# Altium schematic sheet System.SchDoc: goBoard
size A4; Engineer: Paul Schneider; Organization: CS122A; DocumentNumber: 1-; Revision: X0; SheetNumber: 1; SheetTotal: 7; IsUserConfigurable: Yes
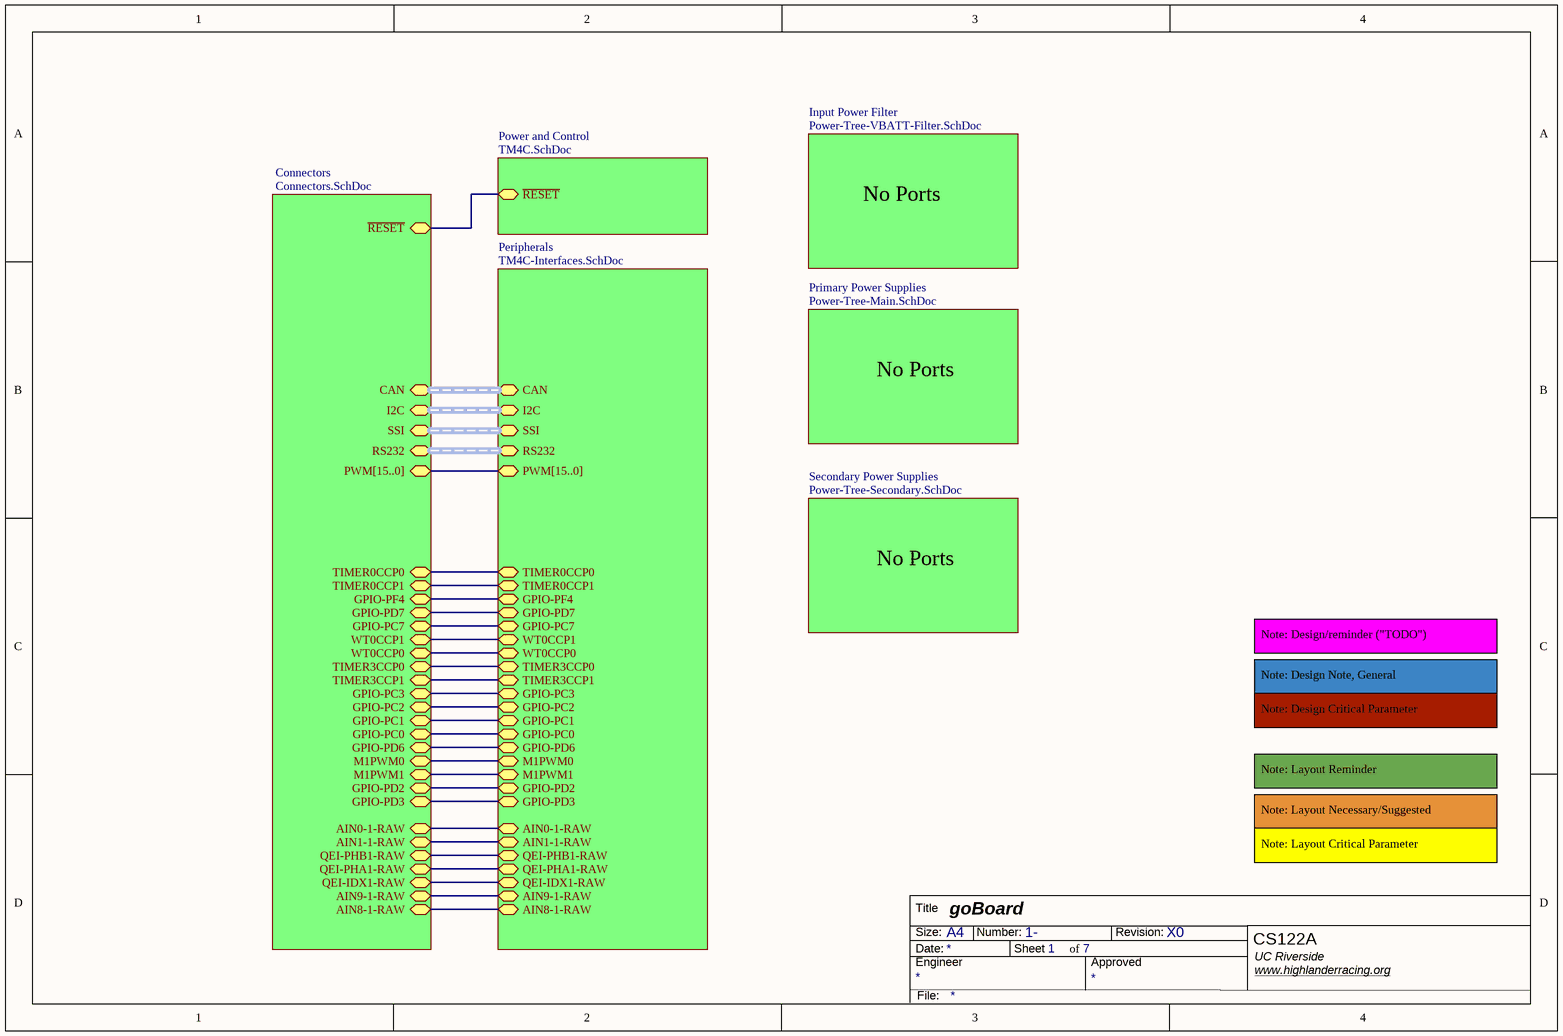
[diagram p0: System.SchDoc]

## Sub-sheets
Connectors = Connectors.SchDoc: CAN (bidir, harness CAN), TIMER0CCP0 (bidir), TIMER0CCP1 (bidir), GPIO-PF4 (bidir), GPIO-PD7 (bidir), GPIO-PC7 (bidir), WT0CCP1 (bidir), WT0CCP0 (bidir), TIMER3CCP0 (bidir), TIMER3CCP1 (bidir), GPIO-PC3 (bidir), GPIO-PC2 (bidir), GPIO-PC1 (bidir), GPIO-PC0 (bidir), GPIO-PD6 (bidir), M1PWM0 (bidir), M1PWM1 (bidir), GPIO-PD2 (bidir), GPIO-PD3 (bidir), AIN0-1-RAW (bidir), AIN1-1-RAW (bidir), QEI-PHB1-RAW (bidir), QEI-PHA1-RAW (bidir), QEI-IDX1-RAW (bidir), AIN9-1-RAW (bidir), AIN8-1-RAW (bidir), SSI (bidir, harness SSI), I2C (bidir, harness I2C), RS232 (bidir, harness RS232), PWM[15..0] (bidir), ~{RESET} (bidir)
Input Power Filter = Power-Tree-VBATT-Filter.SchDoc: no entries
Peripherals = TM4C-Interfaces.SchDoc: CAN (bidir, harness CAN), TIMER0CCP0 (bidir), TIMER0CCP1 (bidir), GPIO-PF4 (bidir), GPIO-PD7 (bidir), GPIO-PC7 (bidir), WT0CCP1 (bidir), WT0CCP0 (bidir), TIMER3CCP0 (bidir), TIMER3CCP1 (bidir), GPIO-PC3 (bidir), GPIO-PC2 (bidir), GPIO-PC1 (bidir), GPIO-PC0 (bidir), GPIO-PD6 (bidir), M1PWM0 (bidir), M1PWM1 (bidir), GPIO-PD2 (bidir), GPIO-PD3 (bidir), AIN0-1-RAW (bidir), AIN1-1-RAW (bidir), QEI-PHB1-RAW (bidir), QEI-PHA1-RAW (bidir), QEI-IDX1-RAW (bidir), AIN9-1-RAW (bidir), AIN8-1-RAW (bidir), PWM[15..0] (bidir), I2C (bidir, harness I2C), SSI (bidir, harness SSI), RS232 (bidir, harness RS232)
Power and Control = TM4C.SchDoc: ~{RESET} (bidir)
Primary Power Supplies = Power-Tree-Main.SchDoc: no entries
Secondary Power Supplies = Power-Tree-Secondary.SchDoc: no entries

## Nets
(unnamed): sheet Connectors/TIMER0CCP0, sheet Peripherals/TIMER0CCP0
(unnamed): sheet Connectors/TIMER0CCP1, sheet Peripherals/TIMER0CCP1
(unnamed): sheet Connectors/GPIO-PF4, sheet Peripherals/GPIO-PF4
(unnamed): sheet Connectors/GPIO-PD7, sheet Peripherals/GPIO-PD7
(unnamed): sheet Connectors/GPIO-PC7, sheet Peripherals/GPIO-PC7
(unnamed): sheet Connectors/WT0CCP1, sheet Peripherals/WT0CCP1
(unnamed): sheet Connectors/WT0CCP0, sheet Peripherals/WT0CCP0
(unnamed): sheet Connectors/TIMER3CCP0, sheet Peripherals/TIMER3CCP0
(unnamed): sheet Connectors/TIMER3CCP1, sheet Peripherals/TIMER3CCP1
(unnamed): sheet Connectors/GPIO-PC3, sheet Peripherals/GPIO-PC3
(unnamed): sheet Connectors/GPIO-PC2, sheet Peripherals/GPIO-PC2
(unnamed): sheet Connectors/GPIO-PC1, sheet Peripherals/GPIO-PC1
(unnamed): sheet Connectors/GPIO-PC0, sheet Peripherals/GPIO-PC0
(unnamed): sheet Connectors/GPIO-PD6, sheet Peripherals/GPIO-PD6
(unnamed): sheet Connectors/M1PWM0, sheet Peripherals/M1PWM0
(unnamed): sheet Connectors/M1PWM1, sheet Peripherals/M1PWM1
(unnamed): sheet Connectors/GPIO-PD2, sheet Peripherals/GPIO-PD2
(unnamed): sheet Connectors/GPIO-PD3, sheet Peripherals/GPIO-PD3
(unnamed): sheet Connectors/AIN0-1-RAW, sheet Peripherals/AIN0-1-RAW
(unnamed): sheet Connectors/AIN1-1-RAW, sheet Peripherals/AIN1-1-RAW
(unnamed): sheet Connectors/QEI-PHB1-RAW, sheet Peripherals/QEI-PHB1-RAW
(unnamed): sheet Connectors/QEI-PHA1-RAW, sheet Peripherals/QEI-PHA1-RAW
(unnamed): sheet Connectors/QEI-IDX1-RAW, sheet Peripherals/QEI-IDX1-RAW
(unnamed): sheet Connectors/AIN9-1-RAW, sheet Peripherals/AIN9-1-RAW
(unnamed): sheet Connectors/AIN8-1-RAW, sheet Peripherals/AIN8-1-RAW
(unnamed): sheet Connectors/~{RESET}, sheet Power and Control/~{RESET}

## Buses and harness runs
bus sheet Connectors/PWM[15..0] = sheet Peripherals/PWM[15..0]
harness sheet Connectors/CAN = sheet Peripherals/CAN
harness sheet Connectors/I2C = sheet Peripherals/I2C
harness sheet Connectors/RS232 = sheet Peripherals/RS232
harness sheet Connectors/SSI = sheet Peripherals/SSI

## Notes on the sheet
- No Ports
- Note: Design/reminder ("TODO")
- Note: Design Note, General
- Note: Design Critical Parameter
- Note: Layout Reminder
- Note: Layout Necessary/Suggested
- Note: Layout Critical Parameter
- Title
- Size:
- Date:
- Engineer
- A4
- Number:
- Sheet
- of
- Approved
- Revision:
- UC Riverside
- www.highlanderracing.org <https://www.highlanderracing.org>
- File: